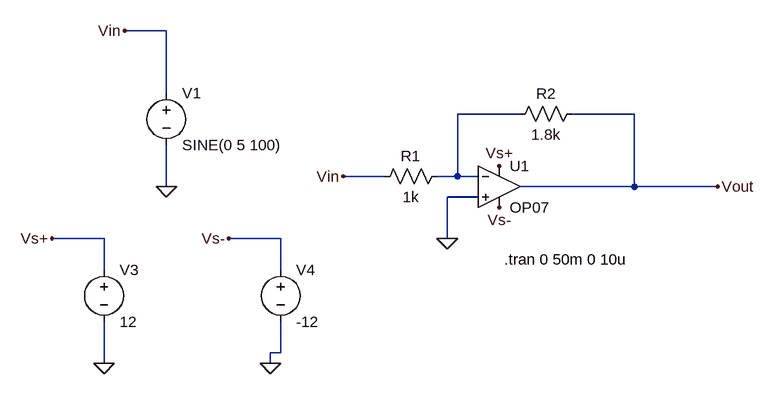
[diagram p0: schematic Task 3.asc]
Task 3.asc, the LTspice schematic file:
Version 4
SHEET 1 968 680
WIRE 48 -400 -16 -400
WIRE 48 -304 48 -400
WIRE 592 -272 496 -272
WIRE 768 -272 672 -272
WIRE 384 -176 320 -176
WIRE 496 -176 496 -272
WIRE 496 -176 464 -176
WIRE 528 -176 496 -176
WIRE 48 -160 48 -224
WIRE 768 -160 768 -272
WIRE 768 -160 592 -160
WIRE 896 -160 768 -160
WIRE 528 -144 480 -144
WIRE -48 -80 -128 -80
WIRE 224 -80 144 -80
WIRE 480 -80 480 -144
WIRE -48 -32 -48 -80
WIRE 224 -32 224 -80
WIRE 224 96 224 48
WIRE 224 96 208 96
WIRE -48 112 -48 48
WIRE 208 112 208 96
FLAG 48 -160 0
FLAG -48 112 0
FLAG 208 112 0
FLAG 480 -80 0
FLAG -16 -400 Vin
FLAG 320 -176 Vin
FLAG -128 -80 Vs+
FLAG 560 -192 Vs+
FLAG 144 -80 Vs-
FLAG 560 -128 Vs-
FLAG 896 -160 Vout
SYMBOL OpAmps\\OP07 560 -224 R0
SYMATTR InstName U1
SYMBOL voltage 48 -320 R0
WINDOW 123 0 0 Left 0
WINDOW 39 0 0 Left 0
SYMATTR InstName V1
SYMATTR Value SINE(0 5 100)
SYMBOL voltage -48 -48 R0
WINDOW 123 0 0 Left 0
WINDOW 39 0 0 Left 0
SYMATTR InstName V3
SYMATTR Value 12
SYMBOL voltage 224 -48 R0
WINDOW 123 0 0 Left 0
WINDOW 39 0 0 Left 0
SYMATTR InstName V4
SYMATTR Value -12
SYMBOL res 480 -192 R90
WINDOW 0 0 56 VBottom 2
WINDOW 3 32 56 VTop 2
SYMATTR InstName R1
SYMATTR Value 1k
SYMBOL res 688 -288 R90
WINDOW 0 0 56 VBottom 2
WINDOW 3 32 56 VTop 2
SYMATTR InstName R2
SYMATTR Value 1.8k
TEXT 568 -48 Left 2 !.tran 0 50m 0 10u

The netlist it stands for:
* Task 3.asc
XU1 0 N001 Vs+ Vs- Vout LT1001  ; OP07, pins In+ In- V+ V- OUT
V1 Vin 0 SINE(0 5 100)
V3 Vs+ 0 12
V4 Vs- 0 -12
R1 N001 Vin 1k
R2 Vout N001 1.8k
.tran 0 50m 0 10u
.lib LTC.lib
.backanno
.end

* Results of the author's LTspice run, read from the files saved beside the schematic
* Operating Point, zero values left out:
*   V(vs+) = 12 V
*   V(vs-) = -12 V
*   I(V4) = 2.25 mA
*   I(V3) = -2.25 mA
*   Ix(u1:3) = 2.25 mA
*   Ix(u1:4) = -2.25 mA
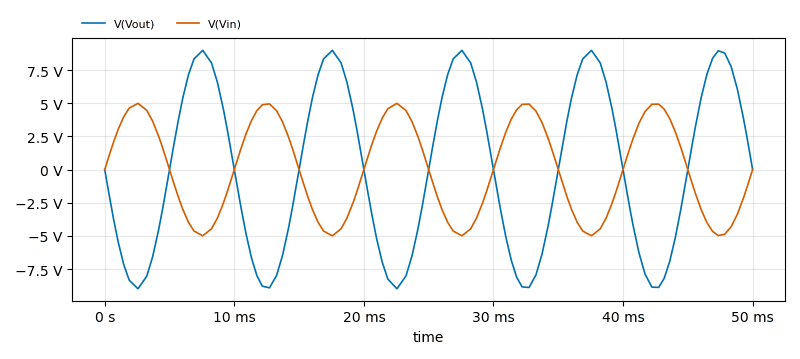
[diagram p1: Transient Analysis of Task 3.asc, plotted from the saved traces]
* Transient Analysis, 1 run:
*   V(Vout): min -8.993 V, max 8.99 V, average -2.31 mV, rms 6.331 V, last 3.011 mV
*   V(Vin): min -4.995 V, max 4.996 V, average 1.283 mV, rms 3.517 V, last 0 V